# EAGLE schematic NodeGeneric.v1.cg2 (EAGLE 4.11)
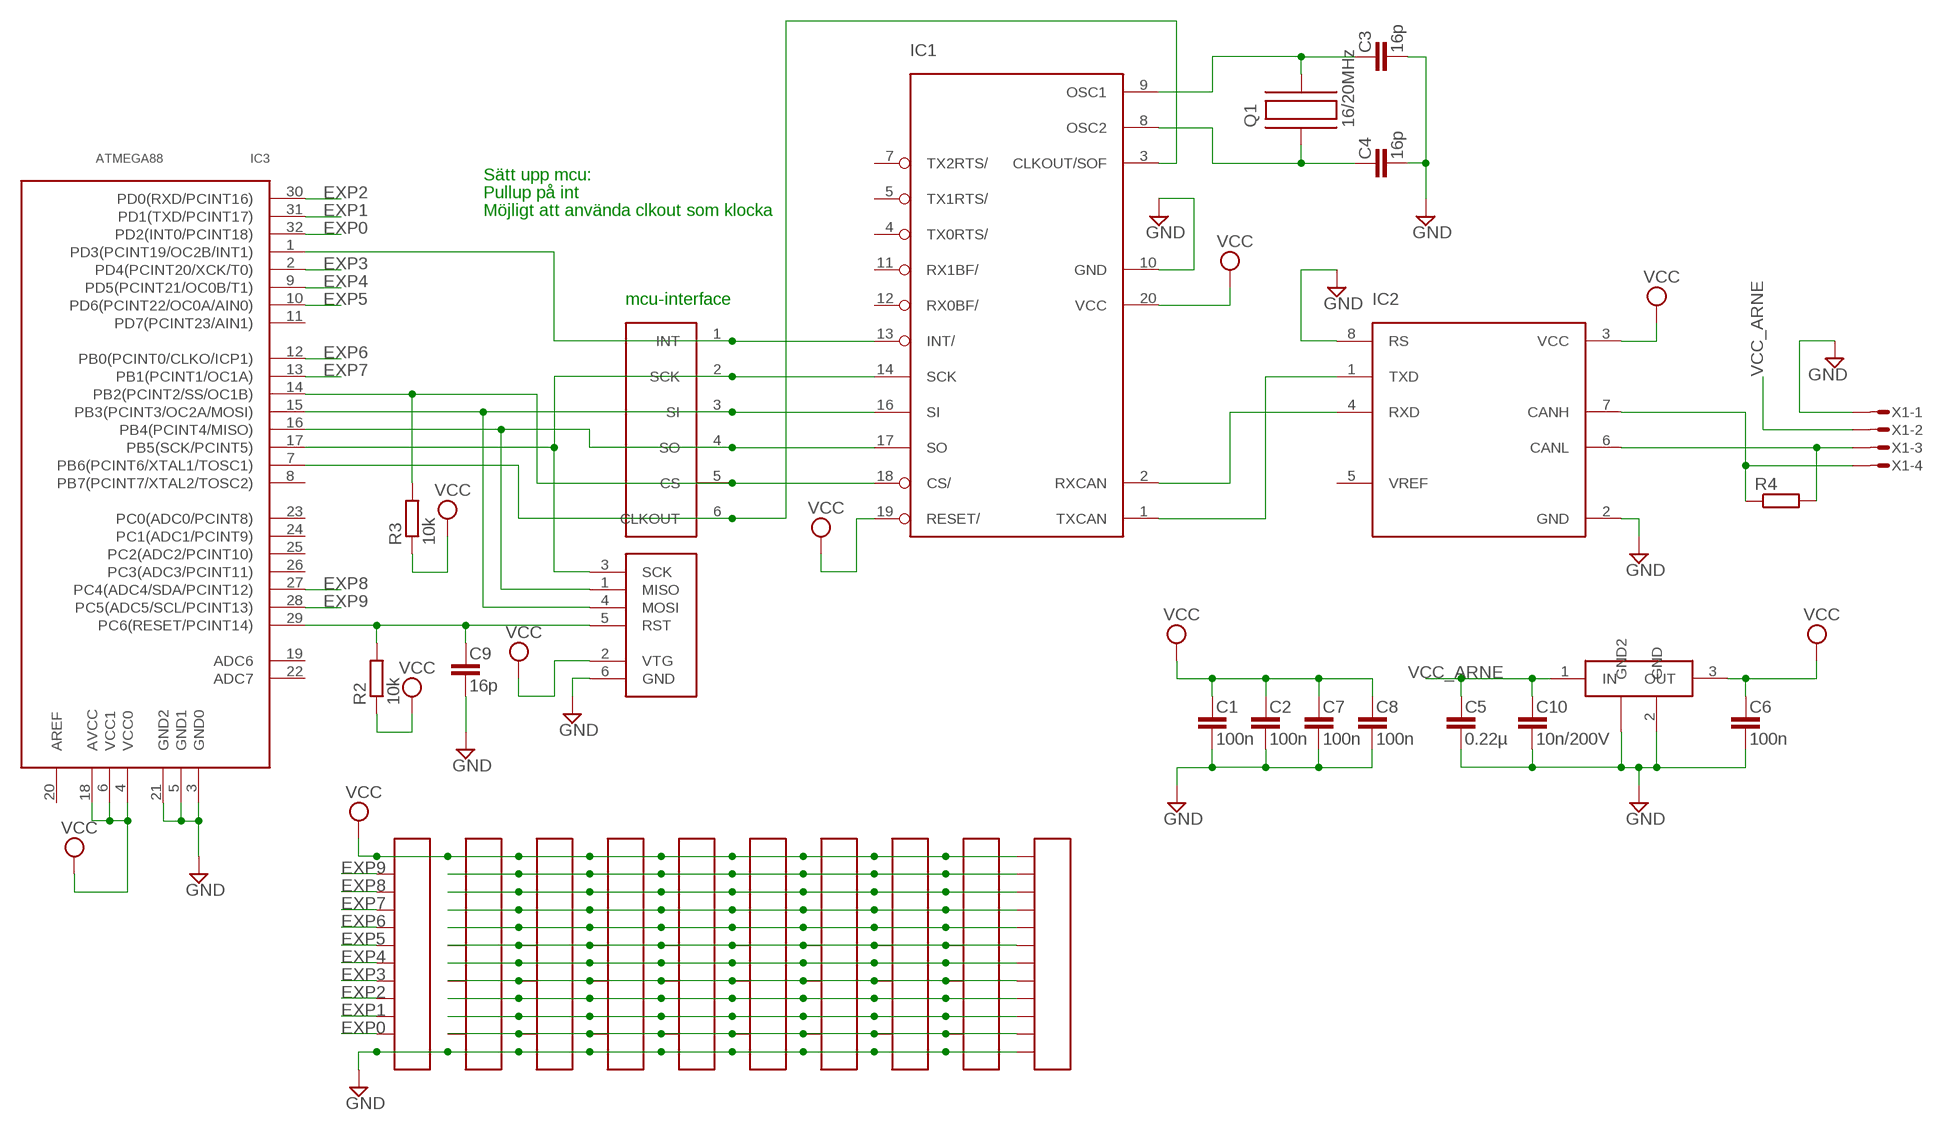
[diagram p0: schematic, sheet 1]

## Parts
C1  100n  C-EU  [C0603]
C2  100n  C-EU  [C0603]
C3  16p  C-EU  [C0603]
C4  16p  C-EU  [C0603]
C5  0.22µ  C-EU  [C0603]
C6  100n  C-EU  [C0603]
C7  100n  C-EU  [C0603]
C8  100n  C-EU  [C0603]
C9  16p  C-EU  [C0603]
C10  10n/200V  C-EU  [C0603]
IC1  MCP2515  [TSSOP]
IC2  MCP2551  [TSSOP]
IC3  ATMEGA88  [TQFP32]
IC4  LM340MP-5.0  [SOT223]
Q1  16/20MHz  C-MAC-LFA147E  [SMD]
R2  10k  R-EU_R0603  [R0603@1]
R3  10k  R-EUR0603  [R0603]
R4  R-EUR0603  [R0603]
U$1  CAN-INTERFACE  [VIA-LIST]
U$3  COLUMN  [COLUMN]
U$4  COLUMN  [COLUMN]
U$5  COLUMN  [COLUMN]
U$6  COLUMN  [COLUMN]
U$7  COLUMN  [COLUMN]
U$8  COLUMN  [COLUMN]
U$9  COLUMN  [COLUMN]
U$10  COLUMN  [COLUMN]
U$11  COLUMN  [COLUMN]
U$12  COLUMN  [COLUMN]
X1  MICROMATCH-4  [MICROMATCH-4-SMD]
X2  ISP  AVRISP6PIN  [6PIN]

## Nets
CANH: IC2.7(CANH) R4.1 X1.4
EXP0: IC3.32(PD2(INT0/PCINT18)) U$3.11
EXP1: IC3.31(PD1(TXD/PCINT17)) U$3.10
EXP2: IC3.30(PD0(RXD/PCINT16)) U$3.9
EXP3: IC3.2(PD4(PCINT20/XCK/T0)) U$3.8
EXP4: IC3.9(PD5(PCINT21/OC0B/T1)) U$3.7
EXP5: IC3.10(PD6(PCINT22/OC0A/AIN0)) U$3.6
EXP6: IC3.12(PB0(PCINT0/CLKO/ICP1)) U$3.5
EXP7: IC3.13(PB1(PCINT1/OC1A)) U$3.4
EXP8: IC3.27(PC4(ADC4/SDA/PCINT12)) U$3.3
EXP9: IC3.28(PC5(ADC5/SCL/PCINT13)) U$3.2
EXP11: U$4.11 U$5.11 U$6.11 U$7.11 U$8.11 U$9.11 U$10.11 U$11.11 U$12.11
EXP12: U$4.10 U$5.10 U$6.10 U$7.10 U$8.10 U$9.10 U$10.10 U$11.10 U$12.10
EXP13: U$4.9 U$5.9 U$6.9 U$7.9 U$8.9 U$9.9 U$10.9 U$11.9 U$12.9
EXP14: U$4.8 U$5.8 U$6.8 U$7.8 U$8.8 U$9.8 U$10.8 U$11.8 U$12.8
EXP15: U$4.7 U$5.7 U$6.7 U$7.7 U$8.7 U$9.7 U$10.7 U$11.7 U$12.7
EXP16: U$4.6 U$5.6 U$6.6 U$7.6 U$8.6 U$9.6 U$10.6 U$11.6 U$12.6
EXP17: U$4.5 U$5.5 U$6.5 U$7.5 U$8.5 U$9.5 U$10.5 U$11.5 U$12.5
EXP18: U$4.4 U$5.4 U$6.4 U$7.4 U$8.4 U$9.4 U$10.4 U$11.4 U$12.4
EXP19: U$4.3 U$5.3 U$6.3 U$7.3 U$8.3 U$9.3 U$10.3 U$11.3 U$12.3
EXP20: U$4.2 U$5.2 U$6.2 U$7.2 U$8.2 U$9.2 U$10.2 U$11.2 U$12.2
GND: C1.2 C2.2 C3.2 C4.2 C5.2 C6.2 C7.2 C8.2 C9.2 C10.2 IC1.10(GND) IC2.2(GND) IC2.8(RS) IC3.3(GND0) IC3.5(GND1) IC3.21(GND2) IC4.2(GND) IC4.4(GND2) U$3.12 U$4.12 U$5.12 U$6.12 U$7.12 U$8.12 U$9.12 U$10.12 U$11.12 U$12.12 X1.1 X2.6(GND)
N$1: IC1.2(RXCAN) IC2.4(RXD)
N$2: IC1.1(TXCAN) IC2.1(TXD)
N$3: C9.1 IC3.29(PC6(RESET/PCINT14)) R2.2 X2.5(RST)
N$4: IC1.13(INT/) IC3.1(PD3(PCINT19/OC2B/INT1)) U$1.1(INT)
N$5: IC2.6(CANL) R4.2 X1.3
N$12: C3.1 IC1.9(OSC1) Q1.P$2
N$13: C4.1 IC1.8(OSC2) Q1.P$1
N$20: IC1.14(SCK) IC3.17(PB5(SCK/PCINT5)) U$1.2(SCK) X2.3(SCK)
N$21: IC1.16(SI) IC3.15(PB3(PCINT3/OC2A/MOSI)) U$1.3(SI) X2.4(MOSI)
N$22: IC1.17(SO) IC3.16(PB4(PCINT4/MISO)) U$1.4(SO) X2.1(MISO)
N$23: IC1.3(CLKOUT/SOF) IC3.7(PB6(PCINT6/XTAL1/TOSC1)) U$1.6(CLKOUT)
N$29: IC1.18(CS/) IC3.14(PB2(PCINT2/SS/OC1B)) R3.2 U$1.5(CS)
VCC: C1.1 C2.1 C6.1 C7.1 C8.1 IC1.19(RESET/) IC1.20(VCC) IC2.3(VCC) IC3.4(VCC0) IC3.6(VCC1) IC3.18(AVCC) IC4.3(OUT) R2.1 R3.1 U$3.1 U$4.1 U$5.1 U$6.1 U$7.1 U$8.1 U$9.1 U$10.1 U$11.1 U$12.1 X2.2(VTG)
VCC_ARNE: C5.1 C10.1 IC4.1(IN) X1.2
Unconnected: IC1.4(TX0RTS/) IC1.5(TX1RTS/) IC1.7(TX2RTS/) IC1.11(RX1BF/) IC1.12(RX0BF/) IC2.5(VREF) IC3.8(PB7(PCINT7/XTAL2/TOSC2)) IC3.11(PD7(PCINT23/AIN1)) IC3.19(ADC6) IC3.20(AREF) IC3.22(ADC7) IC3.23(PC0(ADC0/PCINT8)) IC3.24(PC1(ADC1/PCINT9)) IC3.25(PC2(ADC2/PCINT10)) IC3.26(PC3(ADC3/PCINT11))

## Notes on the sheet
- Sätt upp mcu:
- Pullup på int
- Möjligt att använda clkout som klocka
- mcu-interface

## Library data of the parts
C1-C10 = rcl:C-EU
IC1 = mcp2515:MCP2515
IC2 = mcp2551:MCP2551
IC3 = atmega88:ATMEGA88
IC4 = lm340mp:LM340MP-5.0
Q1 = hc49-4h-smx:C-MAC-LFA147E
R2 = rcl:R-EU_: RESISTOR, European symbol
R3 R4 = rcl:R-EU
U$1 = can-interface:CAN-INTERFACE
U$3-U$12 = expboard:COLUMN
X1 = micromatch-smd:MICROMATCH-4: MicroMaTch 4 7-215464-4 / 0-215464-4 Drawing Number C-215464 DDEController.pdf
X2 = avrisp:AVRISP6PIN